# EAGLE schematic Versie 1 (EAGLE 7.3.0)

## Sheet 1 of 2
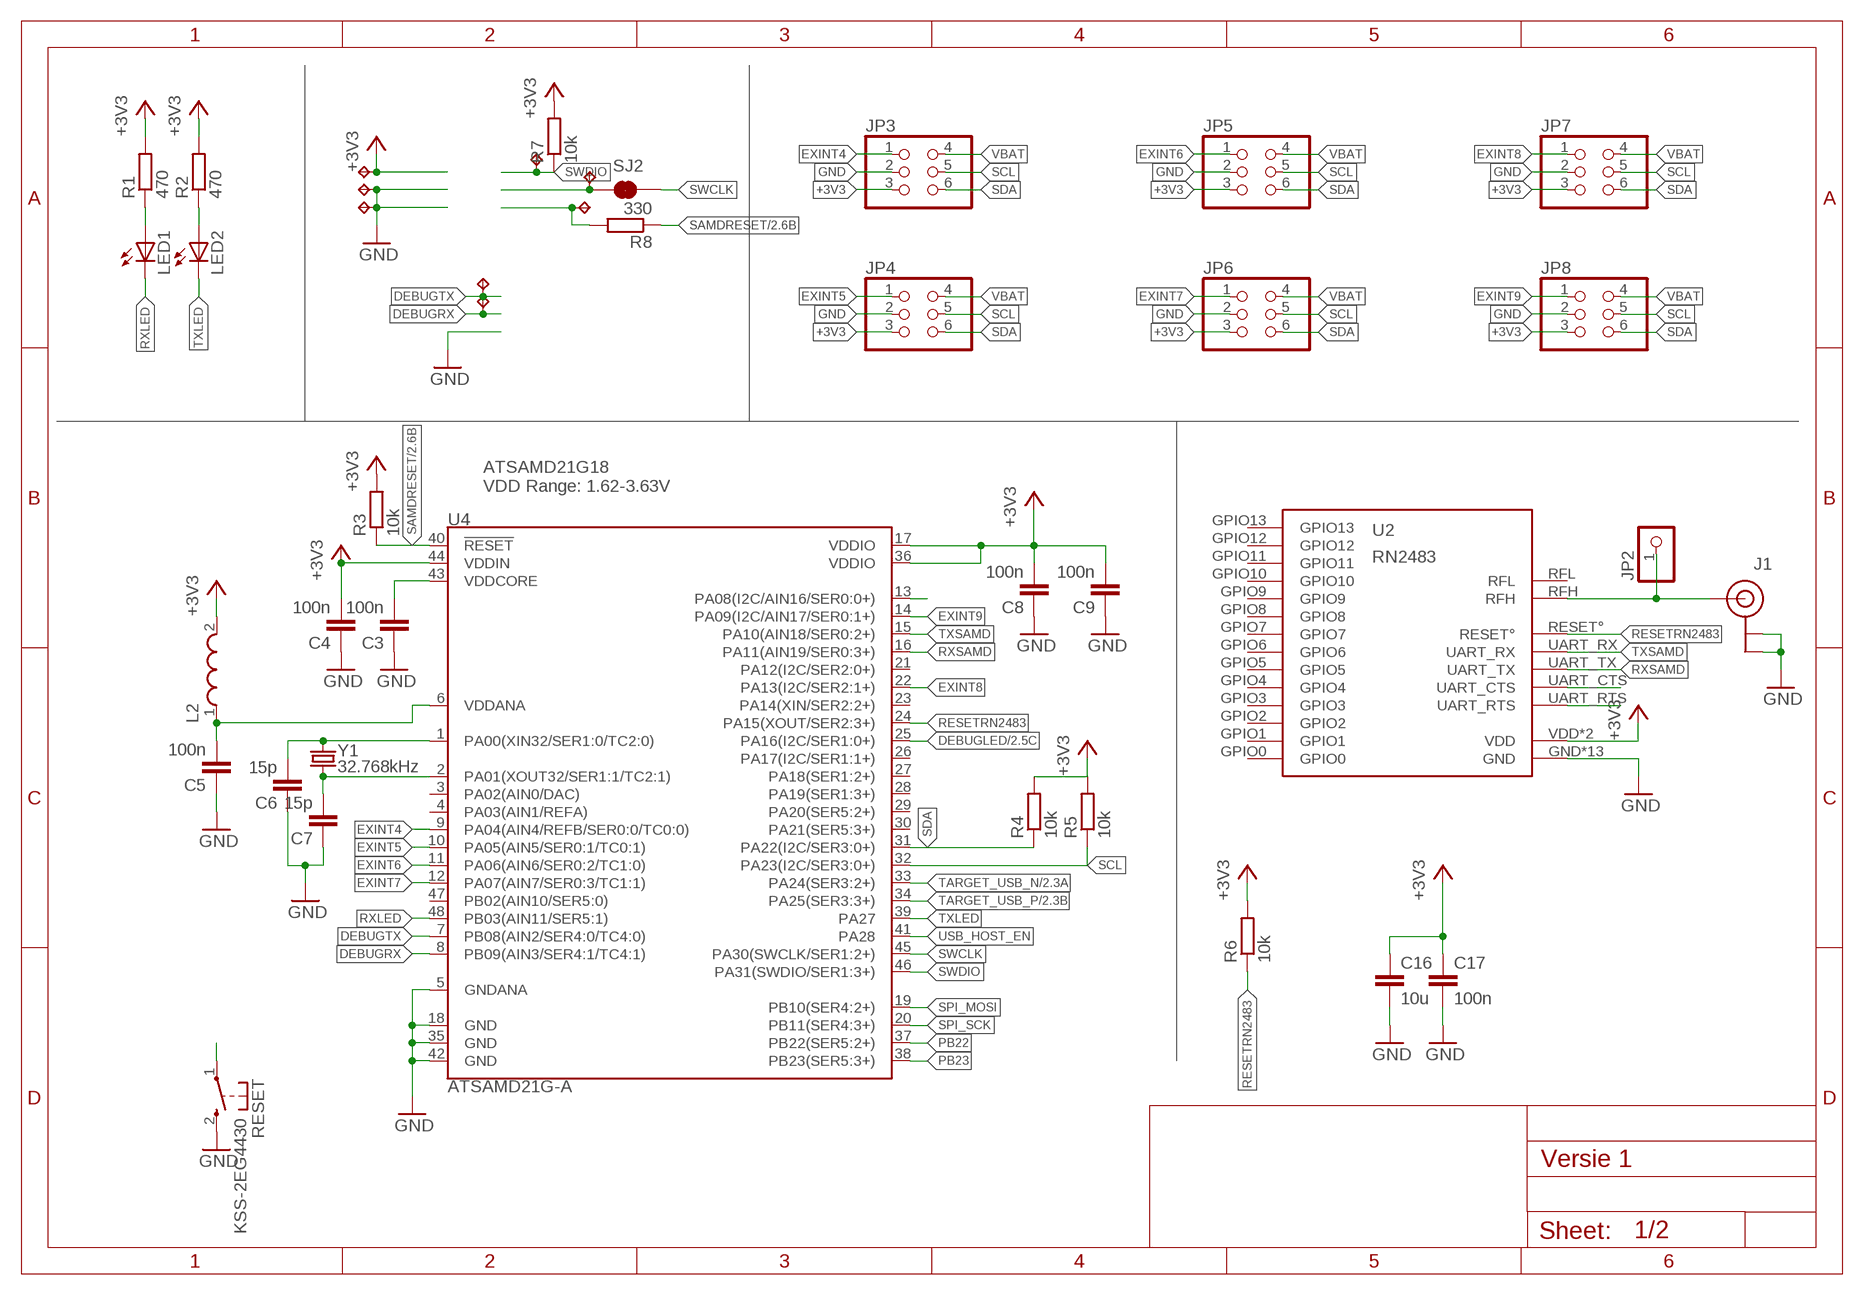
[diagram p0: schematic, sheet 1]

### Parts
C3  100n  C-EUC0603  [C0603]
C4  100n  C-EUC0603  [C0603]
C5  100n  C-EUC0603  [C0603]
C6  15p  C-EUC0603  [C0603]
C7  15p  C-EUC0603  [C0603]
C8  100n  C-EUC0603  [C0603]
C9  100n  C-EUC0603  [C0603]
C16  10u  C-EUC0805  [C0805]
C17  100n  C-EUC0603  [C0603]
J1  U.FL  [U.FL]
JP2  PINHD-1X1  [1X01]
JP3  PINHD-2X3  [2X03]
JP4  PINHD-2X3  [2X03]
JP5  PINHD-2X3  [2X03]
JP6  PINHD-2X3  [2X03]
JP7  PINHD-2X3  [2X03]
JP8  PINHD-2X3  [2X03]
L2  WE-CBA_0603(WB/HS)  [WE-CBA_0603(W=2.2)]
LED1  LEDCHIP-LED0603  [CHIP-LED0603]
LED2  LEDCHIP-LED0603  [CHIP-LED0603]
R1  470  R-EU_R0603  [R0603]
R2  470  R-EU_R0603  [R0603]
R3  10k  R-EU_R0603  [R0603]
R4  10k  R-EU_R0603  [R0603]
R5  10k  R-EU_R0603  [R0603]
R6  10k  R-EU_R0603  [R0603]
R7  10k  R-EU_R0603  [R0603]
R8  330  R-EU_R0603  [R0603]
RESET  KSS-2EG4430  [KSS-2EG4430]
SJ2  JUMPER-PAD-2-NC_BY_TRACENO_SILK  [PAD-JUMPER-2-NC_BY_TRACE_NO_SILK]
TP1  TPB1,27  [B1,27]
TP2  TPB1,27  [B1,27]
TP3  TPB1,27  [B1,27]
TP4  TPB1,27  [B1,27]
TP5  TPB1,27  [B1,27]
TP6  TPB1,27  [B1,27]
TP7  TPB1,27  [B1,27]
TP8  TPB1,27  [B1,27]
U2  RN2483  [RN2483]
U4  ATSAMD21G-A  [TQFP-48]
Y1  32.768kHz  CRYSTAL3.2X1.5MM  [CRYSTAL-SMD-3.2X1.5MM]

### Nets
+3V3: C4.2 C8.2 C9.2 C16.1 C17.1 JP3.3 JP4.3 JP5.3 JP6.3 JP7.3 JP8.3 L2.2 R1.2 R2.2 R3.2 R4.2 R5.2 R6.2 R7.2 TP1.TP U2.VDD U2.VDD2(VDD) U4.17(VDDIO) U4.36(VDDIO) U4.44(VDDIN) ; also sheet 2
BUTTON: U4.13(PA08(I2C/AIN16/SER0:0+)) ; also sheet 2
DEBUGLED: U4.25(PA16(I2C/SER1:0+)) ; also sheet 2
DEBUGRX: TP8.TP U4.8(PB09(AIN3/SER4:1/TC4:1))
DEBUGTX: TP7.TP U4.7(PB08(AIN2/SER4:0/TC4:0))
EXINT4: JP3.1 U4.9(PA04(AIN4/REFB/SER0:0/TC0:0))
EXINT5: JP4.1 U4.10(PA05(AIN5/SER0:1/TC0:1))
EXINT6: JP5.1 U4.11(PA06(AIN6/SER0:2/TC1:0))
EXINT7: JP6.1 U4.12(PA07(AIN7/SER0:3/TC1:1))
EXINT8: JP7.1 U4.22(PA13(I2C/SER2:1+))
EXINT9: JP8.1 U4.14(PA09(I2C/AIN17/SER0:1+))
GND: C3.1 C4.1 C5.1 C6.1 C7.1 C8.1 C9.1 C16.2 C17.2 J1.P$1(GND) J1.P$2(GND) JP3.2 JP4.2 JP5.2 JP6.2 JP7.2 JP8.2 RESET.2(S) TP2.TP TP3.TP U2.GND U2.GND1(GND) U2.GND2(GND) U2.GND3(GND) U2.GND4(GND) U2.GND5(GND) U2.GND6(GND) U2.GND7(GND) U2.GND8(GND) U2.GND9(GND) U2.GND10(GND) U2.GND11(GND) U2.GND12(GND) U4.5(GNDANA) U4.18(GND) U4.35(GND) U4.42(GND) ; also sheet 2
N$1: LED1.A R1.1
N$2: LED2.A R2.1
N$3: SJ2.2 TP5.TP
N$5: C6.2 U4.1(PA00(XIN32/SER1:0/TC2:0)) Y1.P$2
N$6: C7.2 U4.2(PA01(XOUT32/SER1:1/TC2:1)) Y1.P$1
N$7: C5.2 L2.1 U4.6(VDDANA)
N$8: U2.UART_CTS
N$9: U2.UART_RTS
N$10: J1.P$3(SIGNAL) JP2.1 U2.RFH
N$15: R8.2 TP6.TP
PB22: U4.37(PB22(SER5:2+))
PB23: U4.38(PB23(SER5:3+))
RESETRN2483: R6.1 U2.RESET° U4.24(PA15(XOUT/SER2:3+))
RXLED: LED1.C U4.48(PB03(AIN11/SER5:1))
RXSAMD: U2.UART_TX U4.16(PA11(AIN19/SER0:3+))
SAMDRESET: R3.1 R8.1 RESET.1(P) U4.40(!RESET!) ; also sheet 2
SCL: JP3.5 JP4.5 JP5.5 JP6.5 JP7.5 JP8.5 R5.1 U4.32(PA23(I2C/SER3:0+))
SDA: JP3.6 JP4.6 JP5.6 JP6.6 JP7.6 JP8.6 R4.1 U4.31(PA22(I2C/SER3:0+))
SPI_MOSI: U4.19(PB10(SER4:2+))
SPI_SCK: U4.20(PB11(SER4:3+))
SWCLK: SJ2.1 U4.45(PA30(SWCLK/SER1:2+))
SWDIO: R7.1 TP4.TP U4.46(PA31(SWDIO/SER1:3+))
TARGET_USB_N: U4.33(PA24(SER3:2+)) ; also sheet 2
TARGET_USB_P: U4.34(PA25(SER3:3+)) ; also sheet 2
TXLED: LED2.C U4.39(PA27)
TXSAMD: U2.UART_RX U4.15(PA10(AIN18/SER0:2+))
USB_HOST_EN: U4.41(PA28)
VBAT: JP3.4 JP4.4 JP5.4 JP6.4 JP7.4 JP8.4 ; also sheet 2
VDDCORE: C3.2 U4.43(VDDCORE)
Unconnected: U2.GPIO0 U2.GPIO1 U2.GPIO2 U2.GPIO3 U2.GPIO4 U2.GPIO5 U2.GPIO6 U2.GPIO7 U2.GPIO8 U2.GPIO9 U2.GPIO10 U2.GPIO11 U2.GPIO12 U2.GPIO13 U2.RFL U4.3(PA02(AIN0/DAC)) U4.4(PA03(AIN1/REFA)) U4.21(PA12(I2C/SER2:0+)) U4.23(PA14(XIN/SER2:2+)) U4.26(PA17(I2C/SER1:1+)) U4.27(PA18(SER1:2+)) U4.28(PA19(SER1:3+)) U4.29(PA20(SER5:2+)) U4.30(PA21(SER5:3+)) U4.47(PB02(AIN10/SER5:0))

### Notes on the sheet
- ATSAMD21G18
  VDD Range: 1.62-3.63V

## Sheet 2 of 2
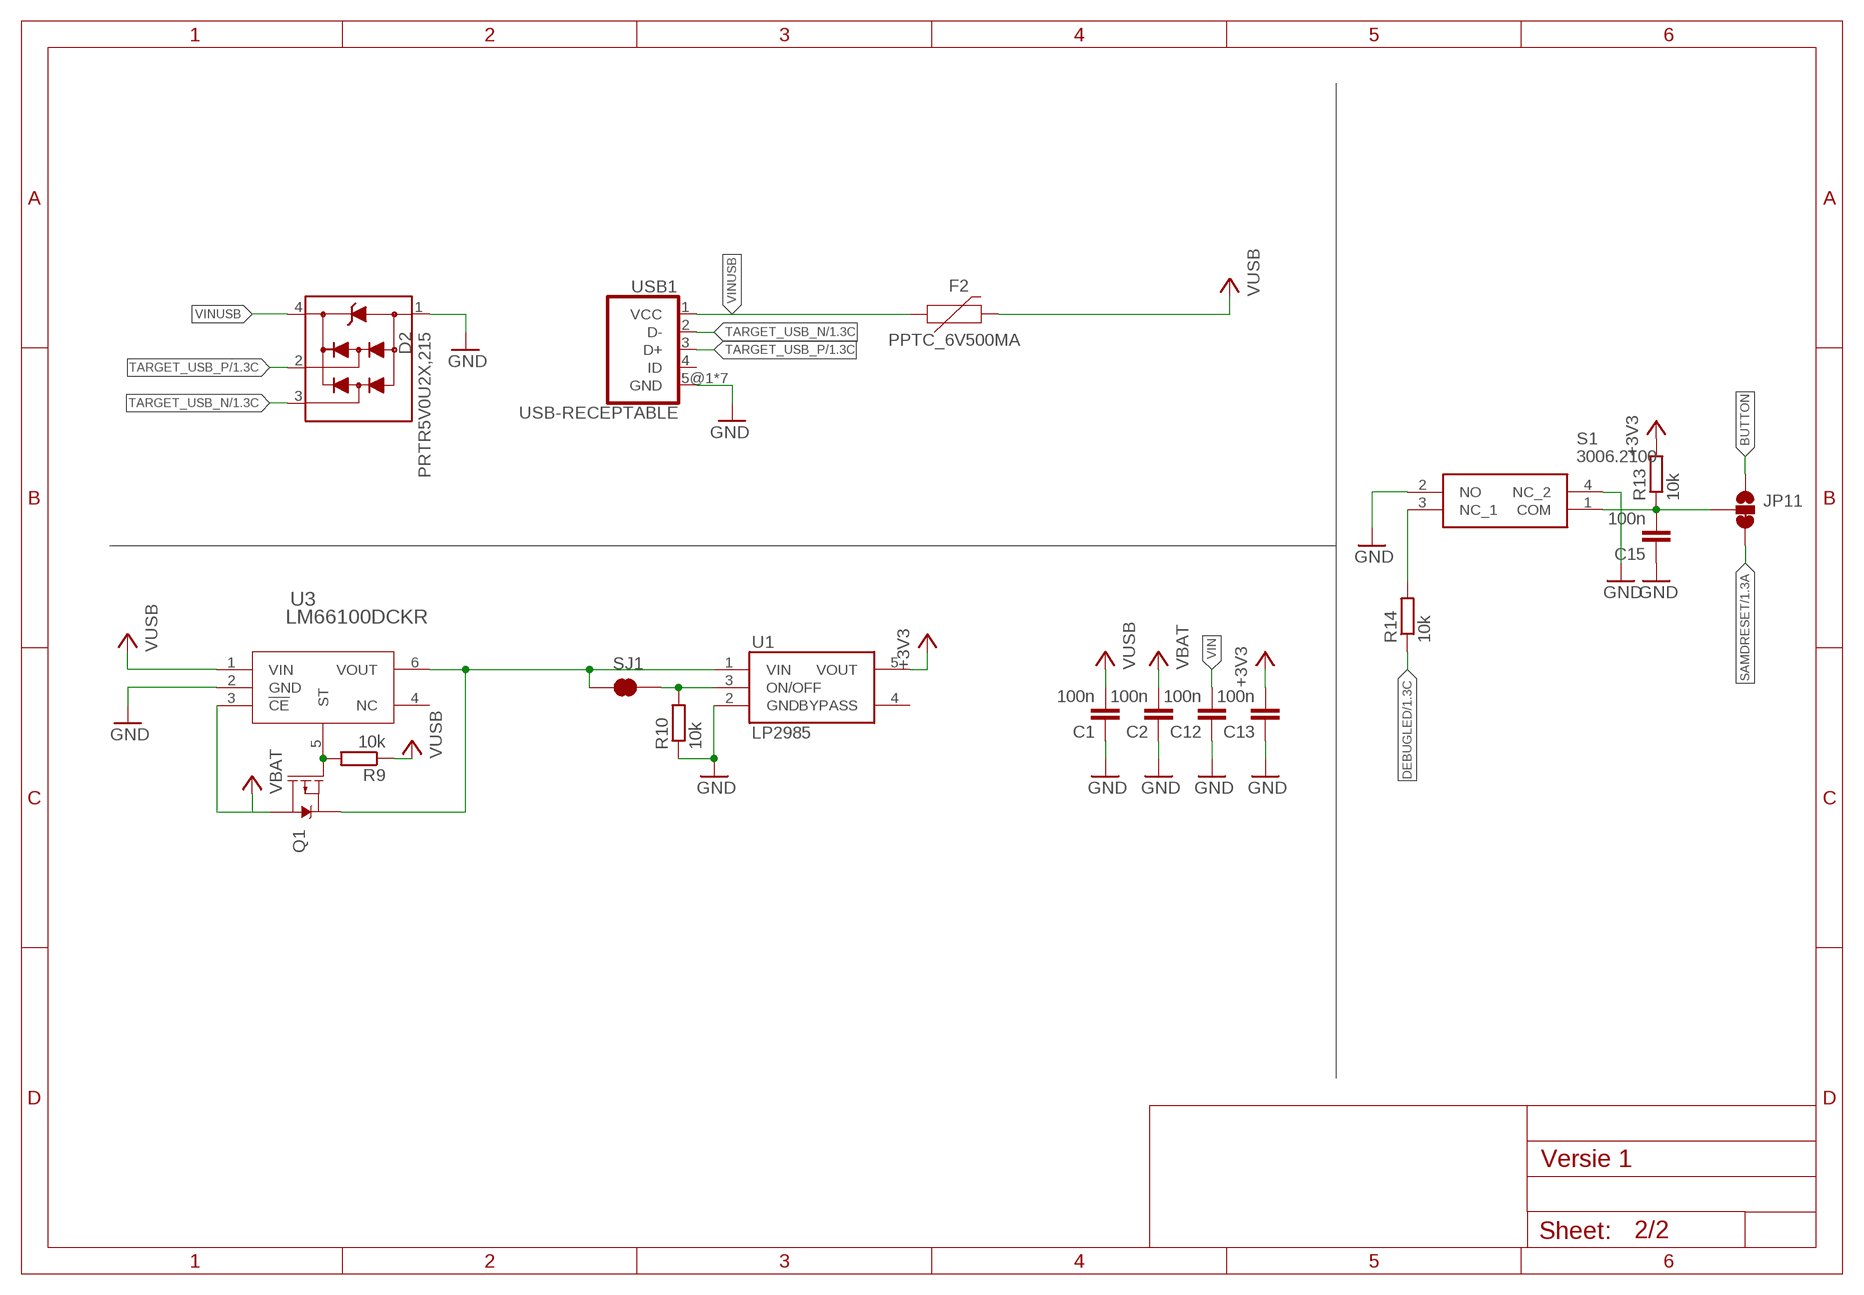
[diagram p1: schematic, sheet 2]

### Parts
C1  100n  C-EUC0603  [C0603]
C2  100n  C-EUC0603  [C0603]
C12  100n  C-EUC0603  [C0603]
C13  100n  C-EUC0603  [C0603]
C15  100n  C-EUC0603  [C0603]
D2  PRTR5V0U2X,215  [SOT143B]
F2  PPTC_6V500MA  [0805]
JP11  JUMPER-SMT_3_1-NC_TRACE_SILK  [SMT-JUMPER_3_1-NC_TRACE_SILK]
Q1  MOSFET_PCH-DMG2307L  [SOT23-3]
R9  10k  R-EU_R0603  [R0603]
R10  10k  R-EU_R0603  [R0603]
R13  10k  R-EU_R0603  [R0603]
R14  10k  R-EU_R0603  [R0603]
S1  3006.2100  [30062101]
SJ1  JUMPER-PAD-2-NC_BY_TRACENO_SILK  [PAD-JUMPER-2-NC_BY_TRACE_NO_SILK]
U1  LP2985AIM5-3.3  [SOT25]
U3  LM66100DCKR  [DCK6_TEX]
USB1  USB-RECEPTABLE  [FCI-10103594-0001LF]

### Nets
+3V3: C13.2 R13.2 U1.5(VOUT) ; also sheet 1
BUTTON: JP11.1 ; also sheet 1
DEBUGLED: R14.1 ; also sheet 1
GND: C1.1 C2.1 C12.1 C13.1 C15.1 D2.1 R10.1 S1.2(NO) S1.4(NC_2) U1.2(GND) U3.2(GND) USB1.5@1(GND) USB1.5@2(GND) USB1.5@3(GND) USB1.5@4(GND) USB1.5@5(GND) USB1.5@6(GND) USB1.5@7(GND) ; also sheet 1
N$14: Q1.1(G) R9.2 U3.5(ST)
N$17: C15.2 JP11.2 R13.1 S1.1(COM)
N$18: R14.2 S1.3(NC_1)
ONOFF: R10.2 SJ1.1 U1.3(ON/OFF)
SAMDRESET: JP11.3 ; also sheet 1
TARGET_USB_N: D2.3 USB1.2(D-) ; also sheet 1
TARGET_USB_P: D2.2 USB1.3(D+) ; also sheet 1
VBAT: C2.2 Q1.3(D) U3.3(!CE) ; also sheet 1
VIN: C12.2 Q1.2(S) SJ1.2 U1.1(VIN) U3.6(VOUT)
VINUSB: D2.4 F2.1 USB1.1(VCC)
VUSB: C1.2 F2.2 R9.1 U3.1(VIN)
Unconnected: U1.4(BYPASS) U3.4(NC) USB1.4(ID)

## Library data of the parts
C1-C9 C12 C13 C15-C17 = rcl:C-EU: CAPACITOR, European symbol
D2 = PRTR5V0U2X_215:PRTR5V0U2X,215: Ultra low capacitance double rail-to-rail ESD protection diode Check prices <https://pricing.snapeda.com/parts/PRTR5V0U2X%2C215/Nexperia%20USA%20Inc./view-part?ref=eda>; AVAILABILITY: Good; DESCRIPTION: Clamp Ipp Tvs Diode Surface Mount SOT-143B; MF: Nexperia USA Inc.; MP: PRTR5V0U2X,215; PACKAGE: None; PRICE: None; PURCHASE-URL: https://pricing.snapeda.com/search/part/PRTR5V0U2X,215/?ref=eda
F2 = SparkFun-Fuses:PPTC: Resettable Fuse PPTC Resettable Fuse. Really a sort of resistor with a polymeric positive temperature coefficient whose resistance increases dramatically with an increase in temperature. When heated by the power passing through the resistance rises causing the current to be limited, protecting the circuit. This is achieved by the transition of the polymer from a crystalline to an amorphous state where the conductive carbon separates breaking the conductive pathways found in the cool crystalline structure. When a PPTC cools back down it resumes conducting letting the circuit turn back on. SparkFun Products: SparkFun RedBoard - Programmed with Arduino <https://www.sparkfun.com/products/12757> Pro Micro - 5V/16MHz <https://www.sparkfun.com/products/12640> Arduino Pro 328 - 5V/16MHz <https://www.sparkfun.com/products/10915> MP3 Trigger <https://www.sparkfun.com/products/13720>
J1 = SparkFun-Connectors:U.FL: SMD antenna connector- WRL-09144; PROD_ID: CONN-09193
JP2 = pinhead:PINHD-1X1: PIN HEADER
JP3-JP8 = pinhead_edge:PINHD-2X3: PIN HEADER
JP11 = SparkFun-Jumpers:JUMPER-SMT_3_1-NC_TRACE: Normally closed trace jumper (1 of 2 connections) This jumper has a trace between two pads so it's normally closed (NC). The other connection is normally open (NO). Use a razor knife to open the connection. For best results follow the IPC guidelines for cutting traces: Cutout at least 0.063 mm (0.005 in). Remove all loose material to clean up the cut area. Seal the cut with an approved epoxy. Reapply solder to reclose the connection, or to close the NO connection.
L2 = EagleLibrary_Wuerth_Elektronik_eiSos_rev16a:WE-CBA: WE-CBA SMD EMI Suppression Ferrite Bead Characteristics Reliable Ni-Sn electrodes High rated current up to 5A Recommended soldering: Reflow Operating temperature: -55°C to +125°C Applications * Perfect as data line filter and for uncoupling of distribution voltage *This special SMD chip bead ferrites can be put directly on the printed circuit board. They offer excellent anti-EMI properties and low DC-resistance. Placed very close next to the interference source even with smallest size 0402,maximal impedance at 1000 Ω can be reached. *High Speed: "High Speed " SMD ferrites WE-CBF have lower impedance in the lower frequency ranges thus they have only a low attenuation for fast signals. Application e.g. USB 2.0, IEEE 1394,LVDS *Wide Band: "Wide Band" SMD ferrites WE-CBF already show high impedance in low frequency range. Therefore they are wide band through the whole spectrum. Application e.g. control signats, RS232, RS422, DC/DC converter *High Current: "High Current " SMD ferrites WE-CBF are designed for high current (over 1 A). The rated current refers to 40K self-heating. High current SMD ferrites are available in all there types (High Speed, Wide Band and High Frequency). Application e.g. power supply, DC/DC converter *Advice: Pay attention for the use of SMD-Ferrites for high current>1A and ambient temperature over +85°C that the rated current has to be reduced when temperature is above +85°C (Derating). *At+100°C environment temperature the maximal rated current has to add up to only 60% of the data sheet value ,without an overload of the component. Variant abbreviation WB means WIDE BAND HS means HIGH SPEED HC means HIGH CURRENT <http://katalog.we-online.de/media/images/eisos/FeCBA_pf2.jpg> Details see: http://katalog.we-online.de/en/pbs/WE-CBA/ Created: 2015-02-02 2015 (C) Wurth Elektronik
LED1 LED2 = led:LED: LED OSRAM: - CHIPLED LG R971, LG N971, LY N971, LG Q971, LY Q971, LO R971, LY R971 LH N974, LH R974 LS Q976, LO Q976, LY Q976 LO Q996 - Hyper CHIPLED LW Q18S LB Q993, LB Q99A, LB R99A - SideLED LS A670, LO A670, LY A670, LG A670, LP A670 LB A673, LV A673, LT A673, LW A673 LH A674 LY A675 LS A676, LA A676, LO A676, LY A676, LW A676 LS A679, LY A679, LG A679 - Hyper Micro SIDELED® LS Y876, LA Y876, LO Y876, LY Y876 LT Y87S - SmartLED LW L88C, LW L88S LB L89C, LB L89S, LG L890 LS L89K, LO L89K, LY L89K LS L896, LA L896, LO L896, LY L896 - TOPLED LS T670, LO T670, LY T670, LG T670, LP T670 LSG T670, LSP T670, LSY T670, LOP T670, LYG T670 LG T671, LOG T671, LSG T671 LB T673, LV T673, LT T673, LW T673 LH T674 LS T676, LA T676, LO T676, LY T676, LB T676, LH T676, LSB T676, LW T676 LB T67C, LV T67C, LT T67C, LS T67K, LO T67K, LY T67K, LW E67C LS E67B, LA E67B, LO E67B, LY E67B, LB E67C, LV E67C, LT E67C LW T67C LS T679, LY T679, LG T679 LS T770, LO T770, LY T770, LG T770, LP T770 LB T773, LV T773, LT T773, LW T773 LH T774 LS E675, LA E675, LY E675, LS T675 LS T776, LA T776, LO T776, LY T776, LB T776 LHGB T686 LT T68C, LB T68C - Hyper Mini TOPLED® LB M676 - Mini TOPLED Santana® LG M470 LS M47K, LO M47K, LY M47K Source: http://www.osram.convergy.de LUXEON: - LUMILED® LXK2-PW12-R00, LXK2-PW12-S00, LXK2-PW14-U00, LXK2-PW14-V00 LXK2-PM12-R00, LXK2-PM12-S00, LXK2-PM14-U00 LXK2-PE12-Q00, LXK2-PE12-R00, LXK2-PE12-S00, LXK2-PE14-T00, LXK2-PE14-U00 LXK2-PB12-K00, LXK2-PB12-L00, LXK2-PB12-M00, LXK2-PB14-N00, LXK2-PB14-P00, LXK2-PB14-Q00 LXK2-PR12-L00, LXK2-PR12-M00, LXK2-PR14-Q00, LXK2-PR14-R00 LXK2-PD12-Q00, LXK2-PD12-R00, LXK2-PD12-S00 LXK2-PH12-R00, LXK2-PH12-S00 LXK2-PL12-P00, LXK2-PL12-Q00, LXK2-PL12-R00 Source: www.luxeon.com KINGBRIGHT: KA-3528ASYC Source: www.kingbright.com
Q1 = SparkFun-DiscreteSemi:MOSFET_PCH: P-channel MOSFETs Voltage controlled devices that allow control of high current outputs. SparkFun Products: SparkFun ESP32 Thing <https://www.sparkfun.com/products/13907> SparkFun ESP8266 Thing <https://www.sparkfun.com/products/13231>; PROD_ID: TRANS-11308; VALUE: 2.5A/30V/105mΩ
R1-R10 R13 R14 = rcl:R-EU_: RESISTOR, European symbol
RESET = buttons:KSS-2EG4430: Size: 3x6mm Height: 5mm from PCB Rating: DC12v 50mA Travel: 0.25±0.10mm Operating Force: 180±50gf Return Force: 60gf min Contact resistance: 100m? max Insulation resistance: 100M? min Operating life?50,000 cycles
S1 = SamacSys_Parts:3006.2100: Tactile Switches TACTILE Source: Datasheet <http://www.mouser.cn/datasheet/2/467/Marquardt_007102018_Specifcation3006_Series-1379934.pdf>; DESCRIPTION: Tactile Switches TACTILE; HEIGHT: 4.15mm; MANUFACTURER_NAME: MARQUARDT; MANUFACTURER_PART_NUMBER: 3006.2100; MOUSER_PART_NUMBER: 979-3006.2100
SJ1 SJ2 = SparkFun-Passives:JUMPER-PAD-2-NC_BY_TRACE
TP1-TP8 = testpad:TP: Test pad
U1 = LP2985:LP2985: LP2985-N Micropower 150 mA Low-Noise Ultra Low-Dropout Regulator
U2 = RN2483:RN2483: RN2483 Microchip Low-Power Lora Transceiver Module NOT TESTED There are testpads on the bottom of the device. The mask is supposed to cover that, but I have not tested it in practice yet. Info: http://www.microchip.com/wwwproducts/Devices.aspx?product=RN2483 Datasheet: http://ww1.microchip.com/downloads/en/DeviceDoc/50002346B.pdf Adapted from: https://github.com/Octanis1/Octanis1-Electronics/blob/ae493cac28c100e20856abe563dfe8824e9cc4bd/lib/Octanis1.lbr
U3 = LM66100:LM66100DCKR; BUILT_BY: EMA_Jessica; COPYRIGHT: Copyright (C) 2018 Accelerated Designs. All rights reserved; MANUFACTURER_PART_NUMBER: LM66100DCKR; SOURCELIBRARY: TI_2019-12-20; VENDOR: Texas Instruments
U4 = samd21-temp:ATSAMD21G: Atmel SAMD21G SMART ARM-Based Microcontroller The Atmel ® | SMART ™ SAM D21 is a series of low-power microcontrollers using the 32-bit ARM ® Cortex ® -M0+ processor, and ranging from 32- to 64-pins with up to 256KB Flash and 32KB of SRAM. The SAM D21 devices operate at a maximum frequency of 48MHz and reach 2.46 CoreMark/MHz. They are designed for simple and intuitive migration with identical peripheral modules, hex compatible code, identical linear address map and pin compatible migration paths between all devices in the product series. All devices include intelligent and flexible peripherals, Atmel Event System for inter-peripheral signaling, and support for capacitive touch button, slider and wheel user interfaces.; PROD_ID: IC-13064
USB1 = daspilker:USB-RECEPTABLE: USB Receptable
Y1 = samd21-temp:CRYSTAL: Various standard crystals. Proven footprints.; PROD_ID: XTAL-13062